# Altium schematic sheet SD card.SchDoc
size A; SheetNumber: 14; SheetTotal: 14
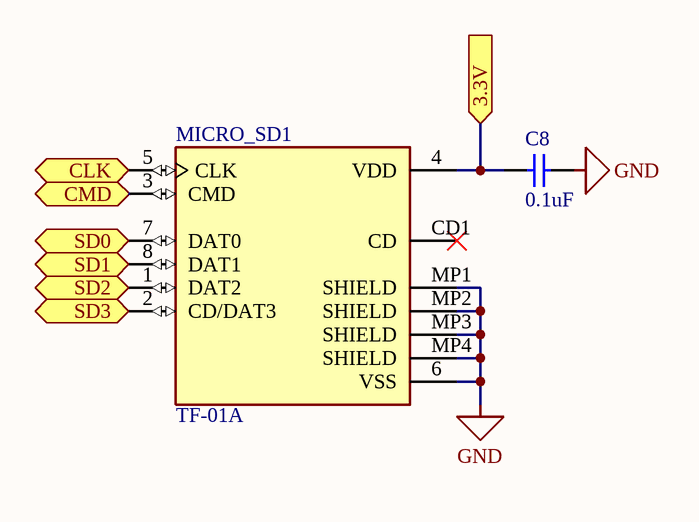
[diagram p0: SD card.SchDoc]

## Parts
C8  0.1uF  [C 0805]
MICRO_SD1  TF-01A  [TF-01A]

## Ports
3.3V (in, see ESP32[1C], Ecternal I2C[2B], MLX Sensor[2B], Navigation switches[2B], Programming Circuit[2B], Regulator 3.3V[3A]), CLK (bidir, see ESP32[2D]), CMD (bidir, see ESP32[2C]), SD0 (bidir, see ESP32[2C]), SD1 (bidir, see ESP32[2C]), SD2 (bidir, see ESP32[2D]), SD3 (bidir, see ESP32[2D])

## Nets
GND: C8.2 MICRO_SD1.6(VSS) MICRO_SD1.MP1(SHIELD) MICRO_SD1.MP2(SHIELD) MICRO_SD1.MP3(SHIELD) MICRO_SD1.MP4(SHIELD)
3.3V: C8.1 MICRO_SD1.4(VDD) ; port 3.3V
CLK: MICRO_SD1.5(CLK) ; port CLK
CMD: MICRO_SD1.3(CMD) ; port CMD
SD0: MICRO_SD1.7(DAT0) ; port SD0
SD1: MICRO_SD1.8(DAT1) ; port SD1
SD2: MICRO_SD1.1(DAT2) ; port SD2
SD3: MICRO_SD1.2(CD/DAT3) ; port SD3

Not connected (* = marked no-connect by the designer): MICRO_SD1 CD1(CD)*

## Library data of the parts
C8 = Capacitor NP: Capacitor non-pol
MICRO_SD1 = TF-01A: Standard Card Edge Connectors; MF: HRO Electronics Co., Ltd.; Price: None; Availability: Not in stock; MP: TF-01A; Package: Package; SnapEDA_Link: https://www.snapeda.com/parts/TF-01A/HRO+Electronics+Co.%252C+Ltd./view-part/?ref=snap; Check_prices: https://www.snapeda.com/parts/TF-01A/HRO+Electronics+Co.%252C+Ltd./view-part/?ref=eda; Value: *